# EAGLE schematic Microsecond clock LEDs (EAGLE 9.5.2)
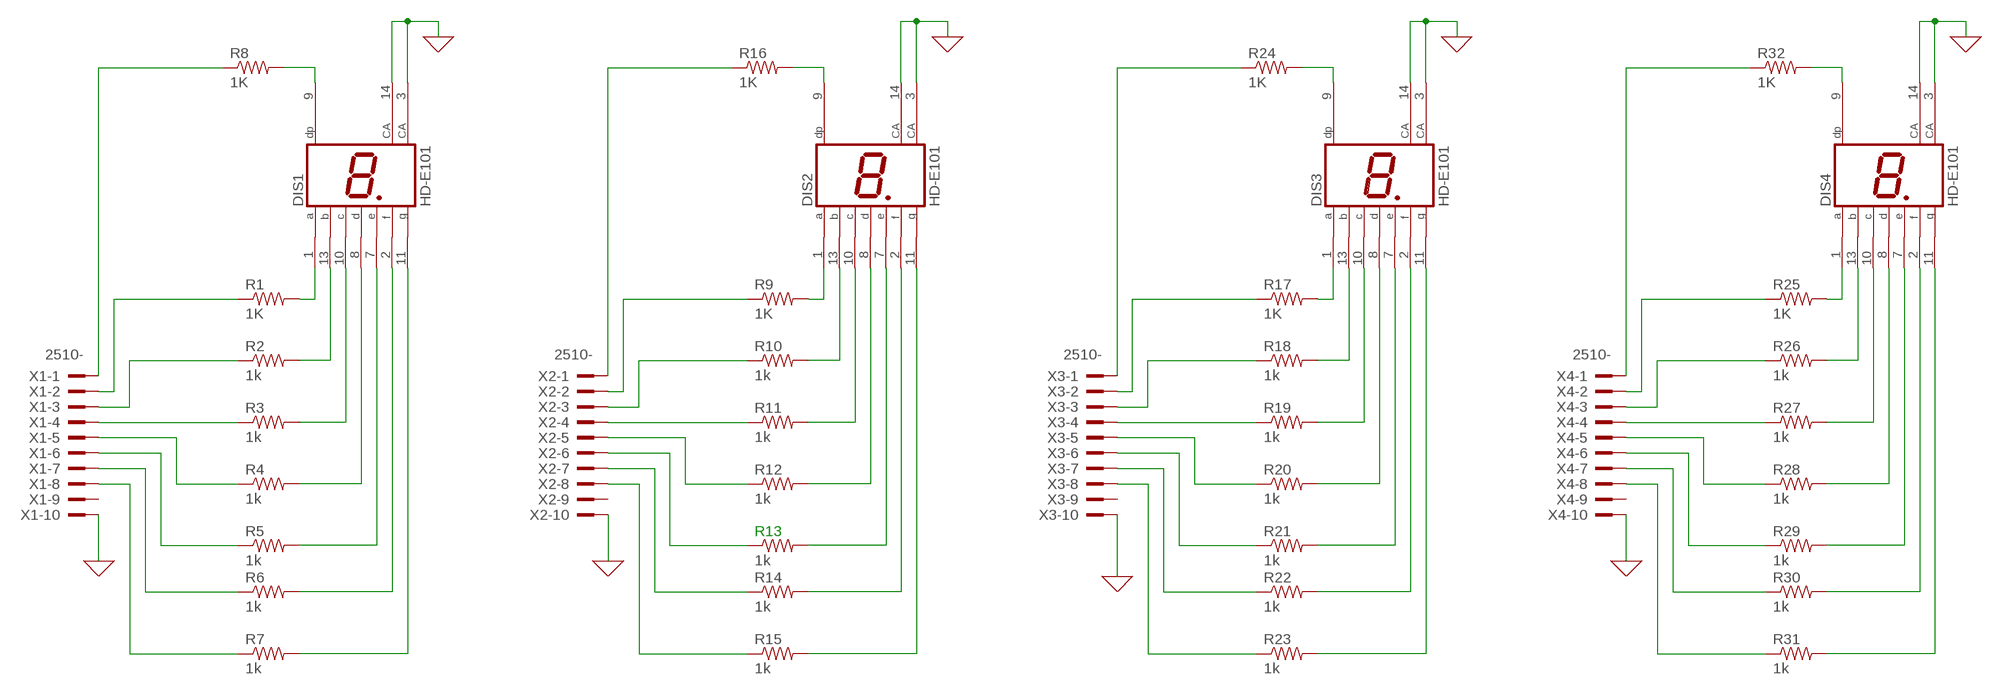
[diagram p0: schematic, sheet 1]

## Parts
DIS1  HD-E101  [HDSP-I]
DIS2  HD-E101  [HDSP-I]
DIS3  HD-E101  [HDSP-I]
DIS4  HD-E101  [HDSP-I]
R1  1K  R-US_0207/7  [0207/7]
R2  1k  R-US_0207/7  [0207/7]
R3  1k  R-US_0207/7  [0207/7]
R4  1k  R-US_0207/7  [0207/7]
R5  1k  R-US_0207/7  [0207/7]
R6  1k  R-US_0207/7  [0207/7]
R7  1k  R-US_0207/7  [0207/7]
R8  1K  R-US_0207/7  [0207/7]
R9  1K  R-US_0207/7  [0207/7]
R10  1k  R-US_0207/7  [0207/7]
R11  1k  R-US_0207/7  [0207/7]
R12  1k  R-US_0207/7  [0207/7]
R13  1k  R-US_0207/7  [0207/7]
R14  1k  R-US_0207/7  [0207/7]
R15  1k  R-US_0207/7  [0207/7]
R16  1K  R-US_0207/7  [0207/7]
R17  1K  R-US_0207/7  [0207/7]
R18  1k  R-US_0207/7  [0207/7]
R19  1k  R-US_0207/7  [0207/7]
R20  1k  R-US_0207/7  [0207/7]
R21  1k  R-US_0207/7  [0207/7]
R22  1k  R-US_0207/7  [0207/7]
R23  1k  R-US_0207/7  [0207/7]
R24  1K  R-US_0207/7  [0207/7]
R25  1K  R-US_0207/7  [0207/7]
R26  1k  R-US_0207/7  [0207/7]
R27  1k  R-US_0207/7  [0207/7]
R28  1k  R-US_0207/7  [0207/7]
R29  1k  R-US_0207/7  [0207/7]
R30  1k  R-US_0207/7  [0207/7]
R31  1k  R-US_0207/7  [0207/7]
R32  1K  R-US_0207/7  [0207/7]
X1  2510-  [PAK100/2500-10]
X2  2510-  [PAK100/2500-10]
X3  2510-  [PAK100/2500-10]
X4  2510-  [PAK100/2500-10]

## Nets
0: DIS1.3(CA) DIS1.14(CA) DIS2.3(CA) DIS2.14(CA) DIS3.3(CA) DIS3.14(CA) DIS4.3(CA) DIS4.14(CA) X1.10 X2.10 X3.10 X4.10 ; supply symbol labelled GND
N$1: DIS1.1(A) R1.2
N$2: DIS1.13(B) R2.2
N$3: DIS1.10(C) R3.2
N$4: DIS1.8(D) R4.2
N$5: DIS1.7(E) R5.2
N$6: DIS1.2(F) R6.2
N$7: DIS1.11(G) R7.2
N$8: DIS1.9(DP) R8.2
N$9: R8.1 X1.1
N$10: R1.1 X1.2
N$11: R2.1 X1.3
N$12: R3.1 X1.4
N$13: R4.1 X1.5
N$14: R5.1 X1.6
N$15: R6.1 X1.7
N$16: R7.1 X1.8
N$17: DIS2.1(A) R9.2
N$18: DIS2.13(B) R10.2
N$19: DIS2.10(C) R11.2
N$20: DIS2.8(D) R12.2
N$21: DIS2.7(E) R13.2
N$22: DIS2.2(F) R14.2
N$23: DIS2.11(G) R15.2
N$24: DIS2.9(DP) R16.2
N$25: R16.1 X2.1
N$26: R9.1 X2.2
N$27: R10.1 X2.3
N$28: R11.1 X2.4
N$29: R12.1 X2.5
N$30: R13.1 X2.6
N$31: R14.1 X2.7
N$32: R15.1 X2.8
N$33: DIS3.1(A) R17.2
N$34: DIS3.13(B) R18.2
N$35: DIS3.10(C) R19.2
N$36: DIS3.8(D) R20.2
N$37: DIS3.7(E) R21.2
N$38: DIS3.2(F) R22.2
N$39: DIS3.11(G) R23.2
N$40: DIS3.9(DP) R24.2
N$41: R24.1 X3.1
N$42: R17.1 X3.2
N$43: R18.1 X3.3
N$44: R19.1 X3.4
N$45: R20.1 X3.5
N$46: R21.1 X3.6
N$47: R22.1 X3.7
N$48: R23.1 X3.8
N$49: DIS4.1(A) R25.2
N$50: DIS4.13(B) R26.2
N$51: DIS4.10(C) R27.2
N$52: DIS4.8(D) R28.2
N$53: DIS4.7(E) R29.2
N$54: DIS4.2(F) R30.2
N$55: DIS4.11(G) R31.2
N$56: DIS4.9(DP) R32.2
N$57: R32.1 X4.1
N$58: R25.1 X4.2
N$59: R26.1 X4.3
N$60: R27.1 X4.4
N$61: R28.1 X4.5
N$62: R29.1 X4.6
N$63: R30.1 X4.7
N$64: R31.1 X4.8
Unconnected: X1.9 X2.9 X3.9 X4.9

## Library data of the parts
DIS1-DIS4 = display-hp:HD-E101: LED DISPLAY 1-character 7 segment, decimal point right; OC_FARNELL: unknown; OC_NEWARK: unknown
R1-R32 = rcl:R-US_: RESISTOR, American symbol; SPICEPREFIX: R
X1-X4 = con-3m:2510-: 3M (TM) Pak 100 4-Wall Header Source: 3M; MF: 3M; MPN: 2510-6002UB; OC_FARNELL: 9838244; OC_NEWARK: 46F4725